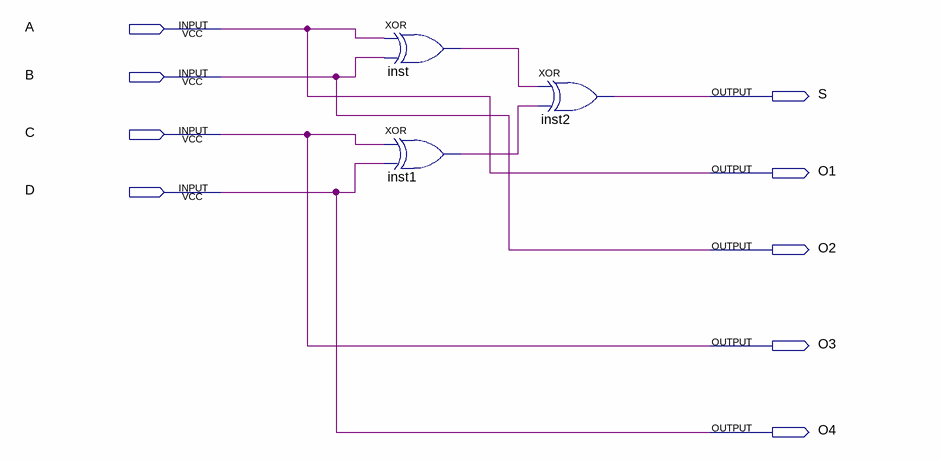
[diagram p0: schematic sheet]
// Quartus schematic even_parity.bdf as structural Verilog: 3 symbols, 9 pins
module even_parity (
  input  A,
  input  B,
  input  C,
  input  D,
  output S,
  output O1,
  output O2,
  output O3,
  output O4
);

  wire inst1_out, inst_out;

  xor inst (inst_out, A, B);
  xor inst1 (inst1_out, C, D);
  xor inst2 (S, inst_out, inst1_out);

  assign O1 = A;
  assign O2 = B;
  assign O3 = C;
  assign O4 = D;
endmodule
